# Altium schematic sheet Smartplug.SchDoc
size A
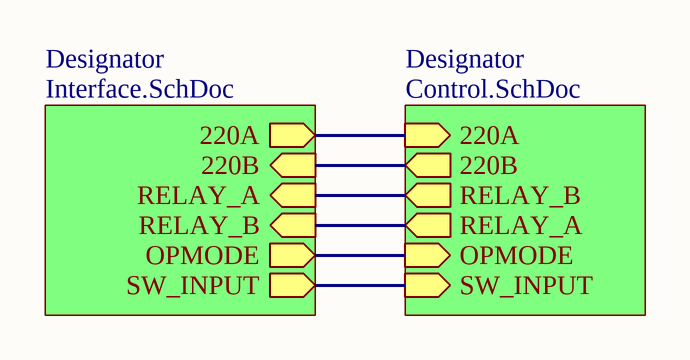
[diagram p0: Smartplug.SchDoc]

## Sub-sheets
Designator = Control.SchDoc: SW_INPUT (in), 220A (in), 220B (out), OPMODE (in), RELAY_A (out), RELAY_B (out)
Designator = Interface.SchDoc: SW_INPUT (out), 220B (in), 220A (out), RELAY_A (in), RELAY_B (in), OPMODE (out)

## Nets
(unnamed): sheet Designator/SW_INPUT, sheet Designator/SW_INPUT
(unnamed): sheet Designator/220A, sheet Designator/220A
(unnamed): sheet Designator/220B, sheet Designator/220B
(unnamed): sheet Designator/OPMODE, sheet Designator/OPMODE
(unnamed): sheet Designator/RELAY_A, sheet Designator/RELAY_B
(unnamed): sheet Designator/RELAY_B, sheet Designator/RELAY_A